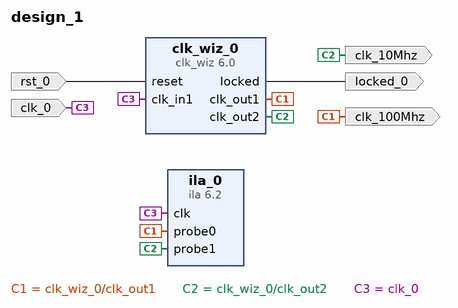
[diagram p0: block diagram of the top level]
# Vivado block design design_1, xc7a100tcsg324-1, Vivado 2019.2
create_bd_design design_1

create_bd_port -dir I -type rst rst_0
set_property -dict {CONFIG.POLARITY ACTIVE_HIGH} [get_bd_ports rst_0]
create_bd_port -dir O clk_100Mhz
create_bd_port -dir O clk_10Mhz
create_bd_port -dir I -type clk clk_0
set_property -dict {CONFIG.FREQ_HZ 100000000} [get_bd_ports clk_0]
create_bd_port -dir O locked_0

create_bd_cell -type ip -vlnv xilinx.com:ip:clk_wiz:6.0 clk_wiz_0
set_property -dict [list \
  CONFIG.CLKOUT1_DRIVES BUFG \
  CONFIG.CLKOUT1_JITTER 130.958 \
  CONFIG.CLKOUT1_PHASE_ERROR 98.575 \
  CONFIG.CLKOUT1_REQUESTED_DUTY_CYCLE 50.0 \
  CONFIG.CLKOUT1_REQUESTED_OUT_FREQ 100.000 \
  CONFIG.CLKOUT1_USED true \
  CONFIG.CLKOUT2_DRIVES BUFG \
  CONFIG.CLKOUT2_JITTER 209.588 \
  CONFIG.CLKOUT2_PHASE_ERROR 98.575 \
  CONFIG.CLKOUT2_REQUESTED_OUT_FREQ 10.000 \
  CONFIG.CLKOUT2_USED true \
  CONFIG.CLKOUT3_DRIVES BUFG \
  CONFIG.CLKOUT4_DRIVES BUFG \
  CONFIG.CLKOUT5_DRIVES BUFG \
  CONFIG.CLKOUT6_DRIVES BUFG \
  CONFIG.CLKOUT7_DRIVES BUFG \
  CONFIG.ENABLE_CLOCK_MONITOR false \
  CONFIG.FEEDBACK_SOURCE FDBK_AUTO \
  CONFIG.JITTER_SEL No_Jitter \
  CONFIG.MMCM_BANDWIDTH OPTIMIZED \
  CONFIG.MMCM_CLKFBOUT_MULT_F 10.000 \
  CONFIG.MMCM_CLKOUT0_DIVIDE_F 10.000 \
  CONFIG.MMCM_CLKOUT0_DUTY_CYCLE 0.500 \
  CONFIG.MMCM_CLKOUT1_DIVIDE 100 \
  CONFIG.MMCM_COMPENSATION ZHOLD \
  CONFIG.MMCM_DIVCLK_DIVIDE 1 \
  CONFIG.NUM_OUT_CLKS 2 \
  CONFIG.PRIMITIVE MMCM \
  CONFIG.PRIM_SOURCE Global_buffer \
  CONFIG.SECONDARY_SOURCE Single_ended_clock_capable_pin \
  CONFIG.USE_DYN_PHASE_SHIFT false \
  CONFIG.USE_FREQ_SYNTH true \
  CONFIG.USE_LOCKED true \
  CONFIG.USE_MIN_POWER false \
  CONFIG.USE_PHASE_ALIGNMENT true \
  CONFIG.USE_RESET true \
  CONFIG.USE_SAFE_CLOCK_STARTUP false \
  CONFIG.USE_SPREAD_SPECTRUM false \
] [get_bd_cells clk_wiz_0]
create_bd_cell -type ip -vlnv xilinx.com:ip:ila:6.2 ila_0
set_property -dict {CONFIG.C_ENABLE_ILA_AXI_MON false CONFIG.C_MONITOR_TYPE Native CONFIG.C_NUM_OF_PROBES 2} [get_bd_cells ila_0]

# ---- connections ----

connect_bd_net [get_bd_pins clk_wiz_0/clk_out1] [get_bd_pins ila_0/probe0] [get_bd_ports clk_100Mhz]
connect_bd_net [get_bd_pins clk_wiz_0/clk_out2] [get_bd_pins ila_0/probe1] [get_bd_ports clk_10Mhz]
connect_bd_net -net rst_0_1 [get_bd_ports rst_0] [get_bd_pins clk_wiz_0/reset]
connect_bd_net -net clk_0_1 [get_bd_ports clk_0] [get_bd_pins clk_wiz_0/clk_in1] [get_bd_pins ila_0/clk]
connect_bd_net [get_bd_pins clk_wiz_0/locked] [get_bd_ports locked_0]

validate_bd_design
save_bd_design
